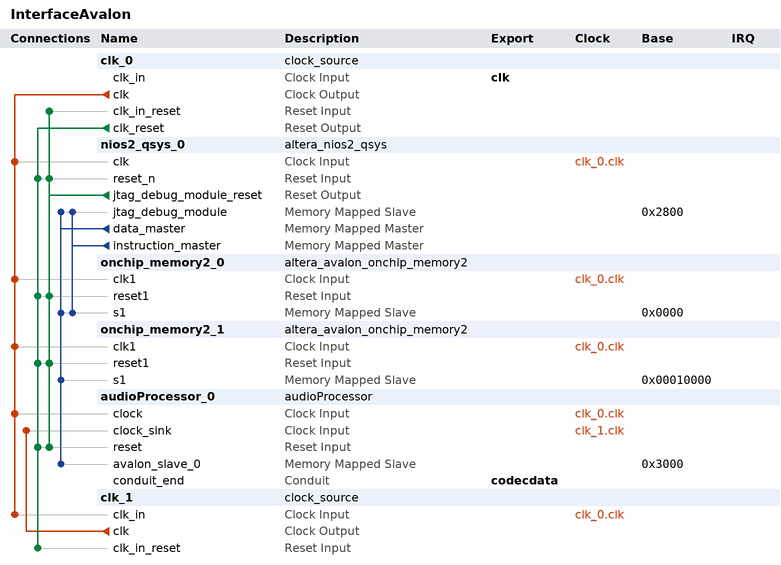
[diagram p0: system contents]
# Platform Designer (Qsys) system InterfaceAvalon, Cyclone IV E EP4CE115F29C7
# Parameters at their usual value, and those the tool derives, are not listed.
package require -exact qsys 17.1
create_system InterfaceAvalon
set_project_property DEVICE_FAMILY {Cyclone IV E}
set_project_property DEVICE EP4CE115F29C7

add_instance clk_0 clock_source 17.1
set_instance_parameter_value clk_0 clockFrequency 50000000

add_instance nios2_qsys_0 altera_nios2_qsys 16.1
set_instance_parameter_value nios2_qsys_0 breakSlave nios2_qsys_0.jtag_debug_module
set_instance_parameter_value nios2_qsys_0 exceptionSlave onchip_memory2_0.s1
set_instance_parameter_value nios2_qsys_0 icache_size 4096
set_instance_parameter_value nios2_qsys_0 impl Tiny
set_instance_parameter_value nios2_qsys_0 mmu_TLBMissExcSlave None
set_instance_parameter_value nios2_qsys_0 resetSlave onchip_memory2_0.s1
set_instance_parameter_value nios2_qsys_0 resetrequest_enabled false

add_instance onchip_memory2_0 altera_avalon_onchip_memory2 17.1
set_instance_parameter_value onchip_memory2_0 dataWidth 32
set_instance_parameter_value onchip_memory2_0 dualPort false
set_instance_parameter_value onchip_memory2_0 initMemContent true
set_instance_parameter_value onchip_memory2_0 initializationFileName onchip_mem.hex
set_instance_parameter_value onchip_memory2_0 memorySize 8192
set_instance_parameter_value onchip_memory2_0 writable false

add_instance onchip_memory2_1 altera_avalon_onchip_memory2 17.1
set_instance_parameter_value onchip_memory2_1 dataWidth 32
set_instance_parameter_value onchip_memory2_1 dualPort false
set_instance_parameter_value onchip_memory2_1 initMemContent true
set_instance_parameter_value onchip_memory2_1 initializationFileName onchip_mem.hex
set_instance_parameter_value onchip_memory2_1 memorySize 65536

add_instance audioProcessor_0 audioProcessor 1.0
set_instance_parameter_value audioProcessor_0 FETCH_MEMORY 1
set_instance_parameter_value audioProcessor_0 IDLE 0
set_instance_parameter_value audioProcessor_0 SEND_CODEC_1 4
set_instance_parameter_value audioProcessor_0 SEND_CODEC_2 8
set_instance_parameter_value audioProcessor_0 WAITING_CODEC 7
set_instance_parameter_value audioProcessor_0 WAITING_DONE_1 2
set_instance_parameter_value audioProcessor_0 WAITING_DONE_2 6
set_instance_parameter_value audioProcessor_0 WAITING_MEMORY_1 3
set_instance_parameter_value audioProcessor_0 WAITING_MEMORY_2 5

add_instance clk_1 clock_source 17.1
set_instance_parameter_value clk_1 clockFrequency 460800

# connections
add_connection clk_0.clk audioProcessor_0.clock clock
add_connection clk_0.clk clk_1.clk_in clock
add_connection clk_0.clk nios2_qsys_0.clk clock
add_connection clk_0.clk onchip_memory2_0.clk1 clock
add_connection clk_0.clk onchip_memory2_1.clk1 clock
add_connection clk_1.clk audioProcessor_0.clock_sink clock
add_connection clk_0.clk_reset audioProcessor_0.reset reset
add_connection clk_0.clk_reset clk_1.clk_in_reset reset
add_connection clk_0.clk_reset nios2_qsys_0.reset_n reset
add_connection clk_0.clk_reset onchip_memory2_0.reset1 reset
add_connection clk_0.clk_reset onchip_memory2_1.reset1 reset
add_connection nios2_qsys_0.jtag_debug_module_reset audioProcessor_0.reset reset
add_connection nios2_qsys_0.jtag_debug_module_reset clk_0.clk_in_reset reset
add_connection nios2_qsys_0.jtag_debug_module_reset nios2_qsys_0.reset_n reset
add_connection nios2_qsys_0.jtag_debug_module_reset onchip_memory2_0.reset1 reset
add_connection nios2_qsys_0.jtag_debug_module_reset onchip_memory2_1.reset1 reset
add_connection nios2_qsys_0.data_master audioProcessor_0.avalon_slave_0 avalon
set_connection_parameter_value nios2_qsys_0.data_master/audioProcessor_0.avalon_slave_0 baseAddress 0x3000
add_connection nios2_qsys_0.data_master nios2_qsys_0.jtag_debug_module avalon
set_connection_parameter_value nios2_qsys_0.data_master/nios2_qsys_0.jtag_debug_module baseAddress 0x2800
add_connection nios2_qsys_0.data_master onchip_memory2_0.s1 avalon
set_connection_parameter_value nios2_qsys_0.data_master/onchip_memory2_0.s1 baseAddress 0x0000
add_connection nios2_qsys_0.data_master onchip_memory2_1.s1 avalon
set_connection_parameter_value nios2_qsys_0.data_master/onchip_memory2_1.s1 baseAddress 0x00010000
add_connection nios2_qsys_0.instruction_master nios2_qsys_0.jtag_debug_module avalon
set_connection_parameter_value nios2_qsys_0.instruction_master/nios2_qsys_0.jtag_debug_module baseAddress 0x2800
add_connection nios2_qsys_0.instruction_master onchip_memory2_0.s1 avalon
set_connection_parameter_value nios2_qsys_0.instruction_master/onchip_memory2_0.s1 baseAddress 0x0000

# exported interfaces
add_interface clk clock sink
set_interface_property clk EXPORT_OF clk_0.clk_in
add_interface codecdata conduit end
set_interface_property codecdata EXPORT_OF audioProcessor_0.conduit_end

set_interconnect_requirement {$system} qsys_mm.clockCrossingAdapter HANDSHAKE
set_interconnect_requirement {$system} qsys_mm.enableEccProtection FALSE
set_interconnect_requirement {$system} qsys_mm.insertDefaultSlave FALSE
set_interconnect_requirement {$system} qsys_mm.maxAdditionalLatency 1

save_system InterfaceAvalon.qsys
